# Altium schematic sheet main.SchDoc
size A4; SheetNumber: 1; SheetTotal: 4
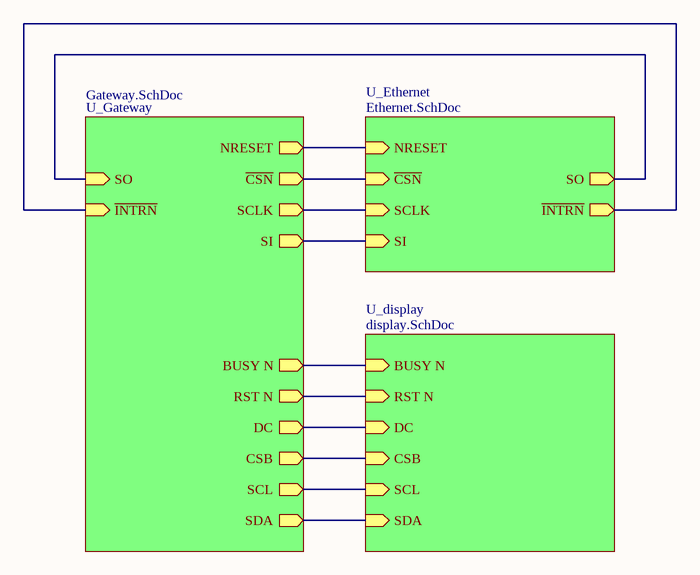
[diagram p0: main.SchDoc]

## Sub-sheets
U_display = display.SchDoc: BUSY N (in), RST N (in), DC (in), CSB (in), SCL (in), SDA (in)
U_Ethernet = Ethernet.SchDoc: ~{INTRN} (out), NRESET (in), ~{CSN} (in), SCLK (in), SI (in), SO (out)
U_Gateway = Gateway.SchDoc: ~{CSN} (out), SO (in), ~{INTRN} (in), SCLK (out), SI (out), NRESET (out), CSB (out), SCL (out), SDA (out), BUSY N (out), DC (out), RST N (out)

## Nets
(unnamed): sheet U_Ethernet/~{INTRN}, sheet U_Gateway/~{INTRN}
(unnamed): sheet U_Ethernet/NRESET, sheet U_Gateway/NRESET
(unnamed): sheet U_Ethernet/~{CSN}, sheet U_Gateway/~{CSN}
(unnamed): sheet U_Ethernet/SCLK, sheet U_Gateway/SCLK
(unnamed): sheet U_Ethernet/SI, sheet U_Gateway/SI
(unnamed): sheet U_Ethernet/SO, sheet U_Gateway/SO
(unnamed): sheet U_Gateway/CSB, sheet U_display/CSB
(unnamed): sheet U_Gateway/SCL, sheet U_display/SCL
(unnamed): sheet U_Gateway/SDA, sheet U_display/SDA
(unnamed): sheet U_Gateway/BUSY N, sheet U_display/BUSY N
(unnamed): sheet U_Gateway/DC, sheet U_display/DC
(unnamed): sheet U_Gateway/RST N, sheet U_display/RST N